# EAGLE design StackOverflow (EAGLE 5.06)
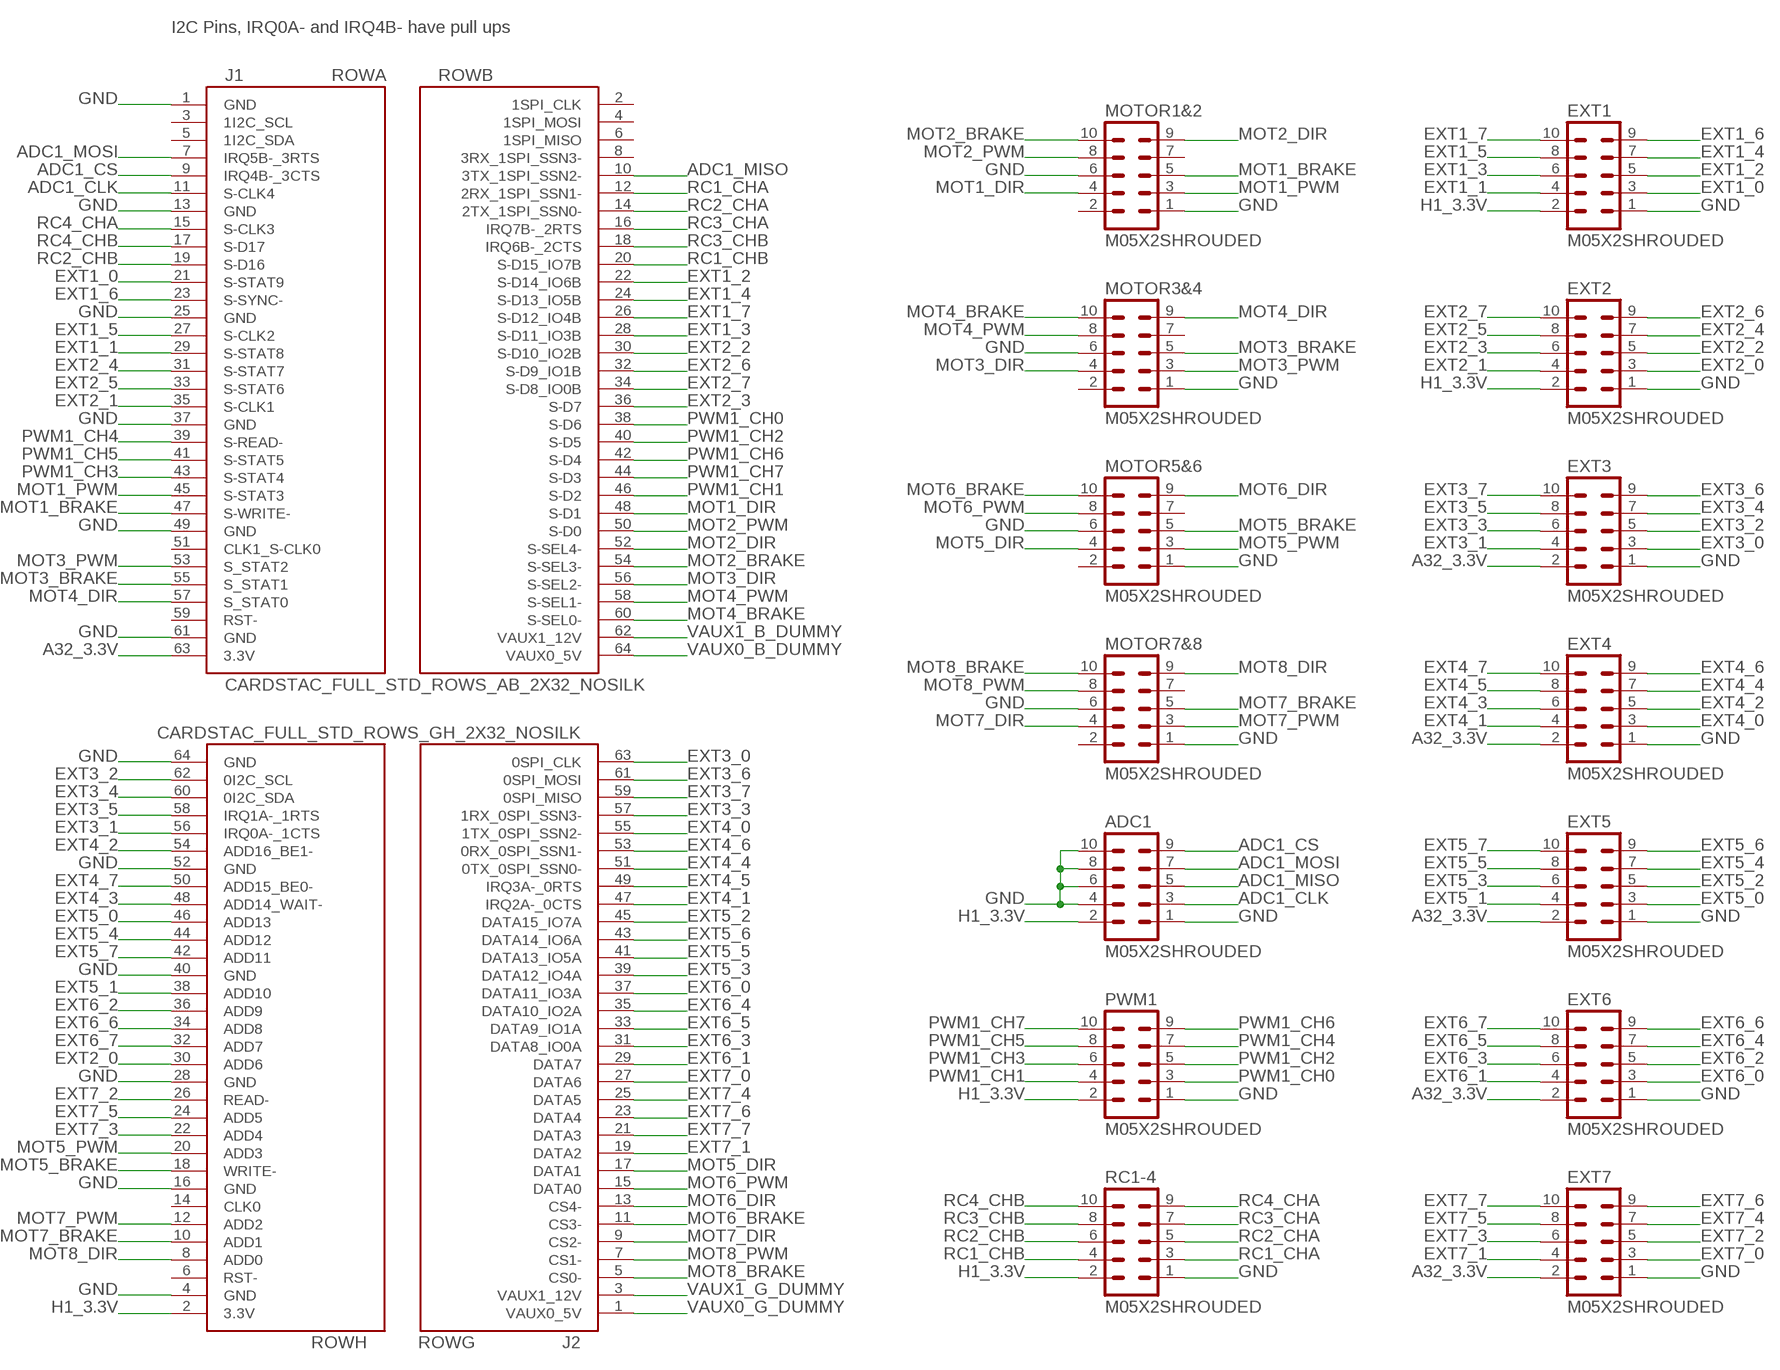
[diagram p0: schematic, sheet 1]

## Parts
ADC1  M05X2SHROUDED  [2X05/SHROUDED]
EXT1  M05X2SHROUDED  [2X05/SHROUDED]
EXT2  M05X2SHROUDED  [2X05/SHROUDED]
EXT3  M05X2SHROUDED  [2X05/SHROUDED]
EXT4  M05X2SHROUDED  [2X05/SHROUDED]
EXT5  M05X2SHROUDED  [2X05/SHROUDED]
EXT6  M05X2SHROUDED  [2X05/SHROUDED]
EXT7  M05X2SHROUDED  [2X05/SHROUDED]
J1  CARDSTAC_FULL_STD_ROWS_AB_2X32_NOSILK  [2X32/NOSILK]
J2  CARDSTAC_FULL_STD_ROWS_GH_2X32_NOSILK  [2X32/NOSILK]
MOTOR1&2  M05X2SHROUDED  [2X05/SHROUDED]
MOTOR3&4  M05X2SHROUDED  [2X05/SHROUDED]
MOTOR5&6  M05X2SHROUDED  [2X05/SHROUDED]
MOTOR7&8  M05X2SHROUDED  [2X05/SHROUDED]
PWM1  M05X2SHROUDED  [2X05/SHROUDED]
RC1-4  M05X2SHROUDED  [2X05/SHROUDED]

## Nets
A32_3.3V: EXT3.2 EXT4.2 EXT5.2 EXT6.2 EXT7.2 J1.63(3.3V)
ADC1_CLK: ADC1.3 J1.11(S-CLK4)
ADC1_CS: ADC1.9 J1.9(IRQ4B-_3CTS)
ADC1_MISO: ADC1.5 J1.10(3TX_1SPI_SSN2-)
ADC1_MOSI: ADC1.7 J1.7(IRQ5B-_3RTS)
EXT1_0: EXT1.3 J1.21(S-STAT9)
EXT1_1: EXT1.4 J1.29(S-STAT8)
EXT1_2: EXT1.5 J1.22(S-D14_IO6B)
EXT1_3: EXT1.6 J1.28(S-D11_IO3B)
EXT1_4: EXT1.7 J1.24(S-D13_IO5B)
EXT1_5: EXT1.8 J1.27(S-CLK2)
EXT1_6: EXT1.9 J1.23(S-SYNC-)
EXT1_7: EXT1.10 J1.26(S-D12_IO4B)
EXT2_0: EXT2.3 J2.30(ADD6)
EXT2_1: EXT2.4 J1.35(S-CLK1)
EXT2_2: EXT2.5 J1.30(S-D10_IO2B)
EXT2_3: EXT2.6 J1.36(S-D7)
EXT2_4: EXT2.7 J1.31(S-STAT7)
EXT2_5: EXT2.8 J1.33(S-STAT6)
EXT2_6: EXT2.9 J1.32(S-D9_IO1B)
EXT2_7: EXT2.10 J1.34(S-D8_IO0B)
EXT3_0: EXT3.3 J2.63(0SPI_CLK)
EXT3_1: EXT3.4 J2.56(IRQ0A-_1CTS)
EXT3_2: EXT3.5 J2.62(0I2C_SCL)
EXT3_3: EXT3.6 J2.57(1RX_0SPI_SSN3-)
EXT3_4: EXT3.7 J2.60(0I2C_SDA)
EXT3_5: EXT3.8 J2.58(IRQ1A-_1RTS)
EXT3_6: EXT3.9 J2.61(0SPI_MOSI)
EXT3_7: EXT3.10 J2.59(0SPI_MISO)
EXT4_0: EXT4.3 J2.55(1TX_0SPI_SSN2-)
EXT4_1: EXT4.4 J2.47(IRQ2A-_0CTS)
EXT4_2: EXT4.5 J2.54(ADD16_BE1-)
EXT4_3: EXT4.6 J2.48(ADD14_WAIT-)
EXT4_4: EXT4.7 J2.51(0TX_0SPI_SSN0-)
EXT4_5: EXT4.8 J2.49(IRQ3A-_0RTS)
EXT4_6: EXT4.9 J2.53(0RX_0SPI_SSN1-)
EXT4_7: EXT4.10 J2.50(ADD15_BE0-)
EXT5_0: EXT5.3 J2.46(ADD13)
EXT5_1: EXT5.4 J2.38(ADD10)
EXT5_2: EXT5.5 J2.45(DATA15_IO7A)
EXT5_3: EXT5.6 J2.39(DATA12_IO4A)
EXT5_4: EXT5.7 J2.44(ADD12)
EXT5_5: EXT5.8 J2.41(DATA13_IO5A)
EXT5_6: EXT5.9 J2.43(DATA14_IO6A)
EXT5_7: EXT5.10 J2.42(ADD11)
EXT6_0: EXT6.3 J2.37(DATA11_IO3A)
EXT6_1: EXT6.4 J2.29(DATA7)
EXT6_2: EXT6.5 J2.36(ADD9)
EXT6_3: EXT6.6 J2.31(DATA8_IO0A)
EXT6_4: EXT6.7 J2.35(DATA10_IO2A)
EXT6_5: EXT6.8 J2.33(DATA9_IO1A)
EXT6_6: EXT6.9 J2.34(ADD8)
EXT6_7: EXT6.10 J2.32(ADD7)
EXT7_0: EXT7.3 J2.27(DATA6)
EXT7_1: EXT7.4 J2.19(DATA2)
EXT7_2: EXT7.5 J2.26(READ-)
EXT7_3: EXT7.6 J2.22(ADD4)
EXT7_4: EXT7.7 J2.25(DATA5)
EXT7_5: EXT7.8 J2.24(ADD5)
EXT7_6: EXT7.9 J2.23(DATA4)
EXT7_7: EXT7.10 J2.21(DATA3)
GND: ADC1.1 ADC1.4 ADC1.6 ADC1.8 ADC1.10 EXT1.1 EXT2.1 EXT3.1 EXT4.1 EXT5.1 EXT6.1 EXT7.1 J1.1(GND) J1.13(GND) J1.25(GND) J1.37(GND) J1.49(GND) J1.61(GND) J2.4(GND) J2.16(GND) J2.28(GND) J2.40(GND) J2.52(GND) J2.64(GND) MOTOR1&2.1 MOTOR1&2.6 MOTOR3&4.1 MOTOR3&4.6 MOTOR5&6.1 MOTOR5&6.6 MOTOR7&8.1 MOTOR7&8.6 PWM1.1 RC1-4.1
H1_3.3V: ADC1.2 EXT1.2 EXT2.2 J2.2(3.3V) PWM1.2 RC1-4.2
MOT1_BRAKE: J1.47(S-WRITE-) MOTOR1&2.5
MOT1_DIR: J1.48(S-D1) MOTOR1&2.4
MOT1_PWM: J1.45(S-STAT3) MOTOR1&2.3
MOT2_BRAKE: J1.54(S-SEL3-) MOTOR1&2.10
MOT2_DIR: J1.52(S-SEL4-) MOTOR1&2.9
MOT2_PWM: J1.50(S-D0) MOTOR1&2.8
MOT3_BRAKE: J1.55(S_STAT1) MOTOR3&4.5
MOT3_DIR: J1.56(S-SEL2-) MOTOR3&4.4
MOT3_PWM: J1.53(S_STAT2) MOTOR3&4.3
MOT4_BRAKE: J1.60(S-SEL0-) MOTOR3&4.10
MOT4_DIR: J1.57(S_STAT0) MOTOR3&4.9
MOT4_PWM: J1.58(S-SEL1-) MOTOR3&4.8
MOT5_BRAKE: J2.18(WRITE-) MOTOR5&6.5
MOT5_DIR: J2.17(DATA1) MOTOR5&6.4
MOT5_PWM: J2.20(ADD3) MOTOR5&6.3
MOT6_BRAKE: J2.11(CS3-) MOTOR5&6.10
MOT6_DIR: J2.13(CS4-) MOTOR5&6.9
MOT6_PWM: J2.15(DATA0) MOTOR5&6.8
MOT7_BRAKE: J2.10(ADD1) MOTOR7&8.5
MOT7_DIR: J2.9(CS2-) MOTOR7&8.4
MOT7_PWM: J2.12(ADD2) MOTOR7&8.3
MOT8_BRAKE: J2.5(CS0-) MOTOR7&8.10
MOT8_DIR: J2.8(ADD0) MOTOR7&8.9
MOT8_PWM: J2.7(CS1-) MOTOR7&8.8
PWM1_CH0: J1.38(S-D6) PWM1.3
PWM1_CH1: J1.46(S-D2) PWM1.4
PWM1_CH2: J1.40(S-D5) PWM1.5
PWM1_CH3: J1.43(S-STAT4) PWM1.6
PWM1_CH4: J1.39(S-READ-) PWM1.7
PWM1_CH5: J1.41(S-STAT5) PWM1.8
PWM1_CH6: J1.42(S-D4) PWM1.9
PWM1_CH7: J1.44(S-D3) PWM1.10
RC1_CHA: J1.12(2RX_1SPI_SSN1-) RC1-4.3
RC1_CHB: J1.20(S-D15_IO7B) RC1-4.4
RC2_CHA: J1.14(2TX_1SPI_SSN0-) RC1-4.5
RC2_CHB: J1.19(S-D16) RC1-4.6
RC3_CHA: J1.16(IRQ7B-_2RTS) RC1-4.7
RC3_CHB: J1.18(IRQ6B-_2CTS) RC1-4.8
RC4_CHA: J1.15(S-CLK3) RC1-4.9
RC4_CHB: J1.17(S-D17) RC1-4.10
VAUX0_B_DUMMY: J1.64(VAUX0_5V)
VAUX0_G_DUMMY: J2.1(VAUX0_5V)
VAUX1_B_DUMMY: J1.62(VAUX1_12V)
VAUX1_G_DUMMY: J2.3(VAUX1_12V)
Unconnected: J1.2(1SPI_CLK) J1.3(1I2C_SCL) J1.4(1SPI_MOSI) J1.5(1I2C_SDA) J1.6(1SPI_MISO) J1.8(3RX_1SPI_SSN3-) J1.51(CLK1_S-CLK0) J1.59(RST-) J2.6(RST-) J2.14(CLK0) MOTOR1&2.2 MOTOR1&2.7 MOTOR3&4.2 MOTOR3&4.7 MOTOR5&6.2 MOTOR5&6.7 MOTOR7&8.2 MOTOR7&8.7

## Notes on the sheet
- I2C Pins, IRQ0A- and IRQ4B- have pull ups

## Library data of the parts
ADC1 EXT1-EXT7 MOTOR1&2 MOTOR3&4 MOTOR5&6 MOTOR7&8 PWM1 RC1-4 = Robot:M05X2: 10-PIN DUAL ROW HEADER Standard 10-pin dual row 0.1" header.
J1 = Robot:CARDSTAC_FULL_STD_ROWS_AB: Rows A and B of the Cardstac specification.
J2 = Robot:CARDSTAC_FULL_STD_ROWS_GH: Rows G and H of the Cardstac specification.

## Board
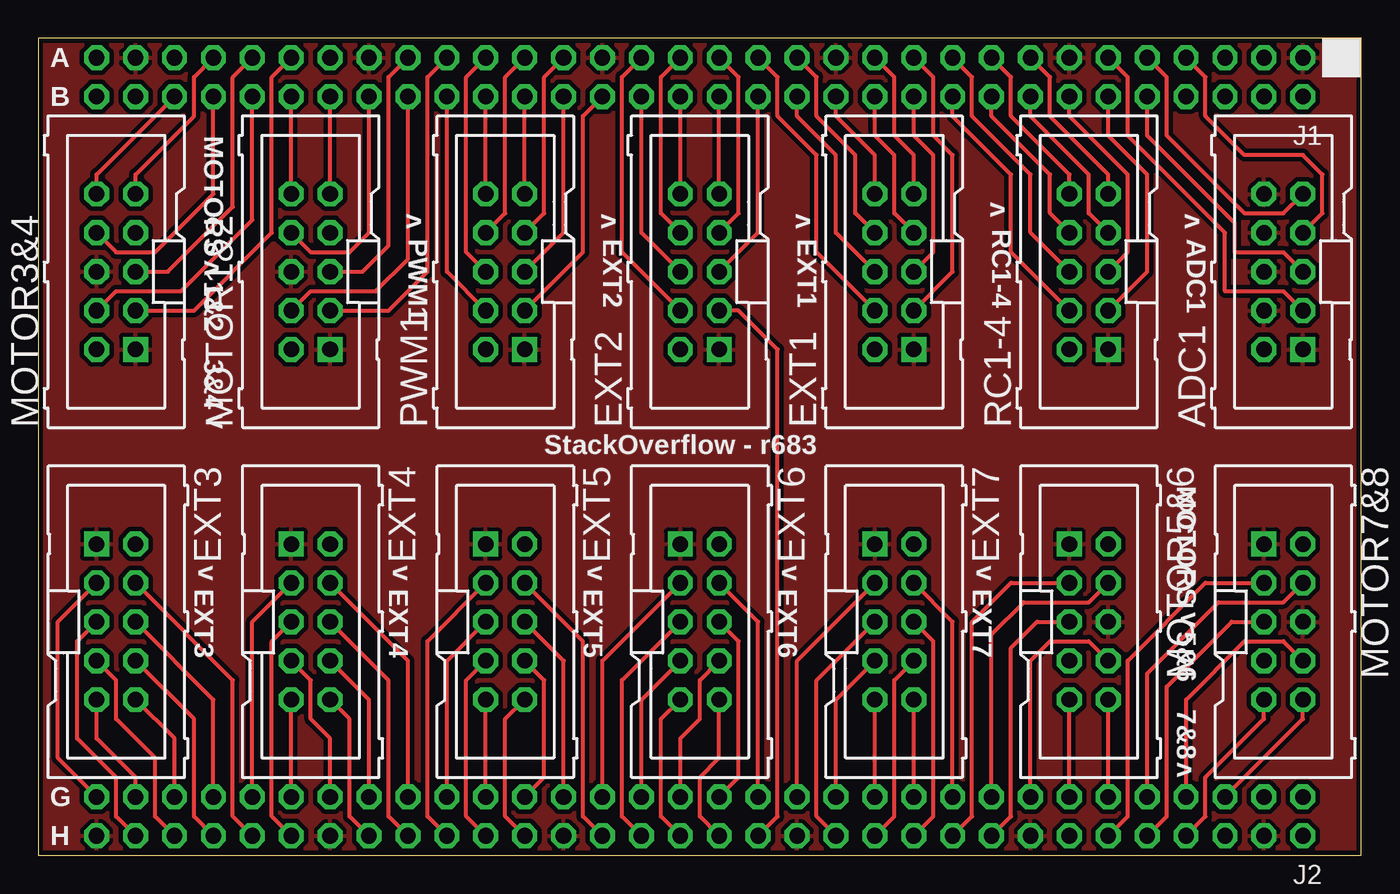
[diagram p1: board, top side]
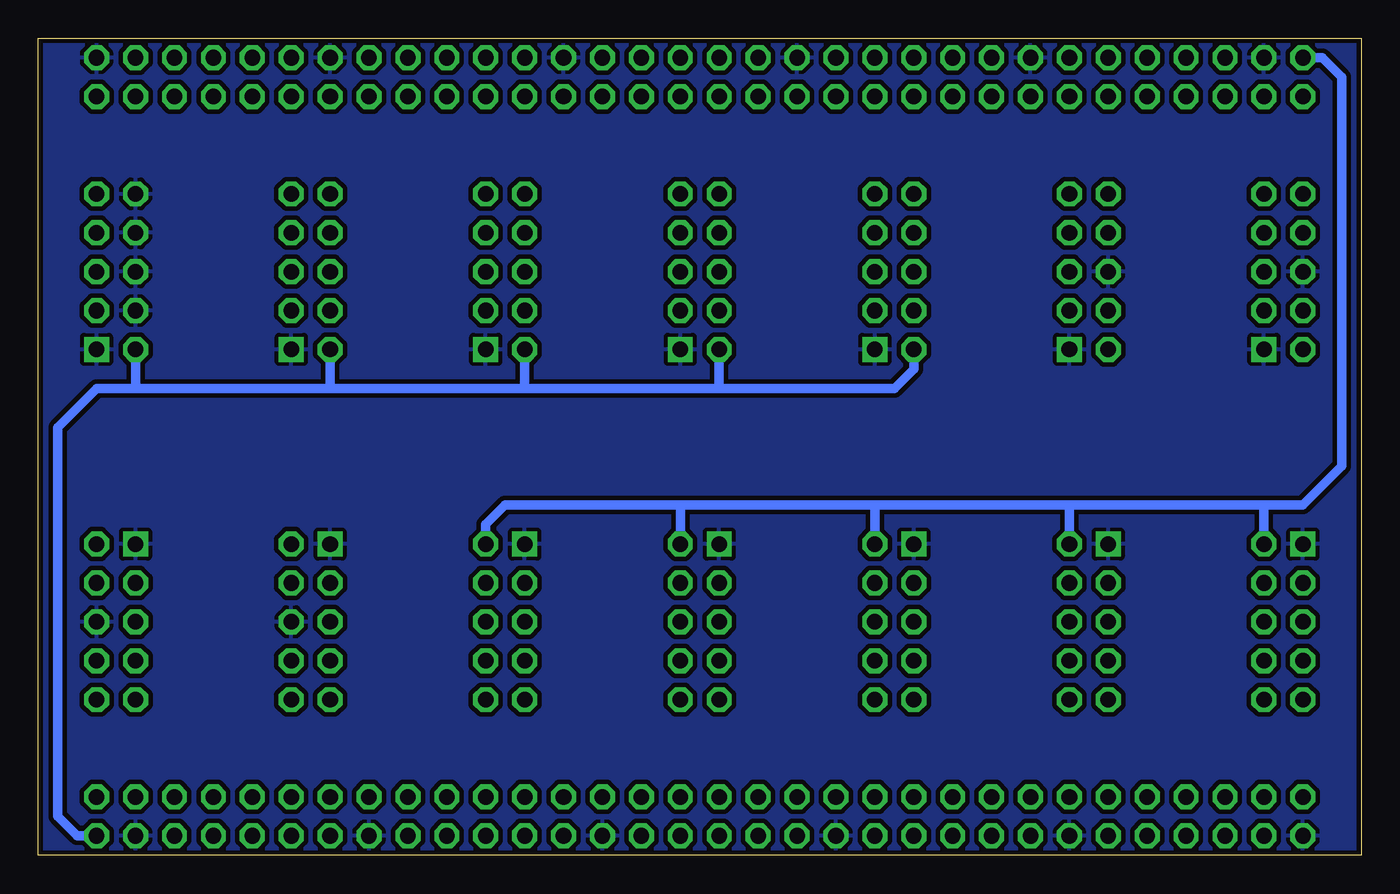
[diagram p2: board, bottom side, seen from below]

Size 86.36 x 53.34 mm. Coordinates in mm from the lower left corner, seen from the top.
Outline: 0,0 86.36,0 86.36,53.34 0,53.34 0,0
Copper layers (1*16): Top 0.035mm / dielectric 1.5mm / Bottom 0.035mm
Design rules "SparkFun": minimum track width 8mil, minimum drill 20mil, track to track 8mil, track to pad 8mil, pad to pad 8mil, via to via 8mil, smd to smd 8mil, copper to edge 10mil, drill to drill 8mil, minimum pad ring 12mil, minimum via ring 10mil, stop-mask expansion 4mil, vias tented up to drill 25mil, thermal gap 10mil

### Footprints (pad centres in the part's own frame; a part is rotated, then mirrored left to right if it is on the bottom)
2X05/SHROUDED = drill 1.016 square: 1 -5.08,-1.27 | drill 1.016 octagon: 2 -5.08,1.27; 3 -2.54,-1.27; 4 -2.54,1.27; 5 0,-1.27; 6 0,1.27; 7 2.54,-1.27; 8 2.54,1.27; 9 5.08,-1.27; 10 5.08,1.27
2X32/NOSILK = drill 1.016 octagon: 1 -39.37,-1.27; 2 -39.37,1.27; 3 -36.83,-1.27; 4 -36.83,1.27; 5 -34.29,-1.27; 6 -34.29,1.27; 7 -31.75,-1.27; 8 -31.75,1.27; 9 -29.21,-1.27; 10 -29.21,1.27; 11 -26.67,-1.27; 12 -26.67,1.27; 13 -24.13,-1.27; 14 -24.13,1.27; 15 -21.59,-1.27; 16 -21.59,1.27; 17 -19.05,-1.27; 18 -19.05,1.27; 19 -16.51,-1.27; 20 -16.51,1.27; 21 -13.97,-1.27; 22 -13.97,1.27; 23 -11.43,-1.27; 24 -11.43,1.27; 25 -8.89,-1.27; 26 -8.89,1.27; 27 -6.35,-1.27; 28 -6.35,1.27; 29 -3.81,-1.27; 30 -3.81,1.27; 31 -1.27,-1.27; 32 -1.27,1.27; 33 1.27,-1.27; 34 1.27,1.27; 35 3.81,-1.27; 36 3.81,1.27; 37 6.35,-1.27; 38 6.35,1.27; 39 8.89,-1.27; 40 8.89,1.27; 41 11.43,-1.27; 42 11.43,1.27; 43 13.97,-1.27; 44 13.97,1.27; 45 16.51,-1.27; 46 16.51,1.27; 47 19.05,-1.27; 48 19.05,1.27; 49 21.59,-1.27; 50 21.59,1.27; 51 24.13,-1.27; 52 24.13,1.27; 53 26.67,-1.27; 54 26.67,1.27; 55 29.21,-1.27; 56 29.21,1.27; 57 31.75,-1.27; 58 31.75,1.27; 59 34.29,-1.27; 60 34.29,1.27; 61 36.83,-1.27; 62 36.83,1.27; 63 39.37,-1.27; 64 39.37,1.27

### Placement (x,y rotation side)
ADC1  81.28,38.1 90 top
EXT1  55.88,38.1 90 top
EXT2  43.18,38.1 90 top
EXT3  5.08,15.24 270 top
EXT4  17.78,15.24 270 top
EXT5  30.48,15.24 270 top
EXT6  43.18,15.24 270 top
EXT7  55.88,15.24 270 top
J1  43.18,50.8 180 top
J2  43.18,2.54 180 top
MOTOR1&2  17.78,38.1 90 top
MOTOR3&4  5.08,38.1 90 top
MOTOR5&6  68.58,15.24 270 top
MOTOR7&8  81.28,15.24 270 top
PWM1  30.48,38.1 90 top
RC1-4  68.58,38.1 90 top

### Tracks (layer width: path | path; a pad name or v marks a point on that pad's centre or on a via)
A32_3.3V
  Bottom 0.61: 6.35,22.86 3.81,22.86 1.27,25.4 1.27,50.8 2.54,52.07 J1.63 | 6.35,22.86 19.05,22.86 | 19.05,22.86 31.75,22.86 | 31.75,22.86 44.45,22.86 | 44.45,22.86 55.88,22.86 57.15,21.59 EXT7.2 | EXT3.2 6.35,22.86 | 31.75,22.86 EXT5.2 | 19.05,22.86 EXT4.2 | 44.45,22.86 EXT6.2
ADC1_CLK
  Top 0.254: J1.11 71.12,50.8 71.12,46.99 77.47,40.64 77.47,36.83 81.28,36.83 ADC1.3
ADC1_CS
  Top 0.254: J1.9 73.66,50.8 73.66,46.99 78.74,41.91 81.28,41.91 ADC1.9
ADC1_MISO
  Top 0.254: J1.10 72.39,46.99 78.11,41.27 78.11,39.37 81.28,39.37 ADC1.5
ADC1_MOSI
  Top 0.254: J1.7 76.2,50.8 76.2,48.26 78.74,45.72 82.55,45.72 83.82,44.45 83.82,41.91 ADC1.7
EXT1_0
  Top 0.254: J1.21 58.42,50.8 58.42,46.99 59.69,45.72 59.69,38.1 EXT1.3
EXT1_1
  Top 0.254: J1.29 48.26,50.8 48.26,48.26 50.8,45.72 50.8,39.37 EXT1.4
EXT1_2
  Top 0.254: J1.22 57.15,46.99 58.42,45.72 58.42,39.37 EXT1.5
EXT1_3
  Top 0.254: EXT1.6 52.07,40.64 52.07,45.72 49.53,48.26 J1.28
EXT1_4
  Top 0.254: J1.24 54.61,46.99 55.88,45.72 55.88,41.91 EXT1.7
EXT1_5
  Top 0.254: J1.27 50.8,50.8 50.8,48.26 53.34,45.72 53.34,41.91 EXT1.8
EXT1_6
  Top 0.254: J1.23 55.88,50.8 55.88,46.99 57.15,45.72 EXT1.9
EXT1_7
  Top 0.254: J1.26 52.07,48.26 54.61,45.72 EXT1.10
EXT2_0
  Top 0.254: J2.30 48.26,2.54 48.26,33.02 45.72,35.56 EXT2.3
EXT2_1
  Top 0.254: EXT2.4 38.1,39.37 38.1,50.8 J1.35
EXT2_2
  Top 0.254: EXT2.5 46.99,40.64 J1.30
EXT2_3
  Top 0.254: J1.36 39.37,40.64 EXT2.6
EXT2_4
  Top 0.254: EXT2.7 45.72,41.91 45.72,50.8 J1.31
EXT2_5
  Top 0.254: EXT2.8 40.64,41.91 40.64,50.8 J1.33
EXT2_6
  Top 0.254: EXT2.9 J1.32
EXT2_7
  Top 0.254: EXT2.10 J1.34
EXT3_0
  Top 0.254: EXT3.3 1.27,15.24 1.27,6.35 J2.63
EXT3_1
  Top 0.254: EXT3.4 12.7,11.43 12.7,2.54 J2.56
EXT3_2
  Top 0.254: EXT3.5 2.54,13.97 2.54,7.62 5.08,5.08 5.08,2.54 J2.62
EXT3_3
  Top 0.254: J2.57 11.43,10.16 EXT3.6
EXT3_4
  Top 0.254: EXT3.7 5.08,11.43 5.08,8.89 7.62,6.35 7.62,2.54 J2.60
EXT3_5
  Top 0.254: EXT3.8 10.16,8.89 10.16,2.54 J2.58
EXT3_6
  Top 0.254: EXT3.9 3.81,7.62 6.35,5.08 J2.61
EXT3_7
  Top 0.254: EXT3.10 8.89,7.62 J2.59
EXT4_0
  Top 0.254: EXT4.3 13.97,15.24 J2.55
EXT4_1
  Top 0.254: EXT4.4 24.13,12.7 J2.47
EXT4_2
  Top 0.254: EXT4.5 15.24,13.97 15.24,2.54 J2.54
EXT4_3
  Top 0.254: EXT4.6 22.86,11.43 22.86,2.54 J2.48
EXT4_4
  Top 0.254: J2.51 19.05,7.62 17.78,8.89 17.78,11.43 EXT4.7
EXT4_5
  Top 0.254: EXT4.8 21.59,10.16 J2.49
EXT4_6
  Top 0.254: J2.53 EXT4.9
EXT4_7
  Top 0.254: EXT4.10 20.32,8.89 20.32,2.54 J2.50
EXT5_0
  Top 0.254: EXT5.3 25.4,13.97 25.4,2.54 J2.46
EXT5_1
  Top 0.254: EXT5.4 35.56,13.97 35.56,2.54 J2.38
EXT5_2
  Top 0.254: EXT5.5 26.67,12.7 J2.45
EXT5_3
  Top 0.254: EXT5.6 34.29,12.7 J2.39
EXT5_4
  Top 0.254: EXT5.7 27.94,11.43 27.94,2.54 J2.44
EXT5_5
  Top 0.254: EXT5.8 33.02,11.43 33.02,5.08 J2.41
EXT5_6
  Top 0.254: J2.43 EXT5.9
EXT5_7
  Top 0.254: EXT5.10 30.48,8.89 30.48,2.54 J2.42
EXT6_0
  Top 0.254: EXT6.3 36.83,12.7 J2.37
EXT6_1
  Top 0.254: EXT6.4 46.99,15.24 J2.29
EXT6_2
  Top 0.254: EXT6.5 38.1,11.43 38.1,2.54 J2.36
EXT6_3
  Top 0.254: EXT6.6 45.72,13.97 45.72,5.08 J2.31
EXT6_4
  Top 0.254: EXT6.7 39.37,10.16 J2.35
EXT6_5
  Top 0.254: J2.33 41.91,7.62 43.18,8.89 43.18,11.43 EXT6.8
EXT6_6
  Top 0.254: EXT6.9 40.64,8.89 40.64,2.54 J2.34
EXT6_7
  Top 0.254: J2.32 43.18,2.54 43.18,5.08 44.45,6.35 EXT6.10
EXT7_0
  Top 0.254: EXT7.3 49.53,12.7 J2.27
EXT7_1
  Top 0.254: EXT7.4 59.69,15.24 J2.19
EXT7_2
  Top 0.254: EXT7.5 50.8,11.43 50.8,2.54 J2.26
EXT7_3
  Top 0.254: EXT7.6 58.42,13.97 58.42,2.54 J2.22
EXT7_4
  Top 0.254: EXT7.7 52.07,10.16 J2.25
EXT7_5
  Top 0.254: J2.24 55.88,2.54 55.88,11.43 EXT7.8
EXT7_6
  Top 0.254: J2.23 EXT7.9
EXT7_7
  Top 0.254: J2.21 EXT7.10
GND
  pour Top (isolate 0.305): 0,0 0,53.34 86.36,53.34 86.36,0
  pour Bottom (isolate 0.305): 0,0 0,53.34 86.36,53.34 86.36,0
H1_3.3V
  Bottom 0.61: J2.2 83.82,1.27 85.09,2.54 85.09,27.94 82.55,30.48 80.01,30.48 | 54.61,30.48 67.31,30.48 | 67.31,30.48 80.01,30.48 | 54.61,30.48 EXT1.2 | 41.91,30.48 30.48,30.48 29.21,31.75 PWM1.2 | 41.91,30.48 54.61,30.48 | 67.31,30.48 RC1-4.2 | 80.01,30.48 ADC1.2 | 41.91,30.48 EXT2.2
MOT1_BRAKE
  Top 0.254: J1.47 22.86,50.8 22.86,39.8 21.16,38.1 MOTOR1&2.5
MOT1_DIR
  Top 0.254: MOTOR1&2.4 17.78,36.83 22.02,36.83 24.13,38.94 J1.48
MOT1_PWM
  Top 0.254: J1.45 25.4,50.8 25.4,38.1 22.86,35.56 MOTOR1&2.3
MOT2_BRAKE
  Top 0.254: MOTOR1&2.10 J1.54
MOT2_DIR
  Top 0.254: MOTOR1&2.9 J1.52
MOT2_PWM
  Top 0.254: J1.50 21.59,40.64 20.32,39.37 17.78,39.37 MOTOR1&2.8
MOT3_BRAKE
  Top 0.254: J1.55 12.7,50.8 12.7,42.34 8.46,38.1 MOTOR3&4.5
MOT3_DIR
  Top 0.254: J1.56 13.97,41.48 9.32,36.83 5.08,36.83 MOTOR3&4.4
MOT3_PWM
  Top 0.254: J1.53 15.24,50.8 15.24,40.64 10.16,35.56 MOTOR3&4.3
MOT4_BRAKE
  Top 0.254: MOTOR3&4.10 3.81,44.45 J1.60
MOT4_DIR
  Top 0.254: J1.57 10.16,50.8 10.16,48.26 6.35,44.45 MOTOR3&4.9
MOT4_PWM
  Top 0.254: MOTOR3&4.8 5.08,39.37 7.62,39.37 11.43,43.18 J1.58
MOT5_BRAKE
  Top 0.254: J2.18 63.5,2.54 63.5,13.54 65.2,15.24 MOTOR5&6.5
MOT5_DIR
  Top 0.254: MOTOR5&6.4 68.58,16.51 64.34,16.51 62.23,14.4 J2.17
MOT5_PWM
  Top 0.254: J2.20 60.96,2.54 60.96,15.24 63.5,17.78 MOTOR5&6.3
MOT6_BRAKE
  Top 0.254: J2.11 MOTOR5&6.10
MOT6_DIR
  Top 0.254: J2.13 MOTOR5&6.9
MOT6_PWM
  Top 0.254: MOTOR5&6.8 68.58,13.97 66.04,13.97 64.77,12.7 J2.15
MOT7_BRAKE
  Top 0.254: J2.10 73.66,2.54 73.66,11 77.9,15.24 MOTOR7&8.5
MOT7_DIR
  Top 0.254: MOTOR7&8.4 81.28,16.51 77.04,16.51 72.39,11.86 J2.9
MOT7_PWM
  Top 0.254: J2.12 71.12,2.54 71.12,12.7 76.2,17.78 MOTOR7&8.3
MOT8_BRAKE
  Top 0.254: J2.5 82.55,8.89 MOTOR7&8.10
MOT8_DIR
  Top 0.254: J2.8 76.2,2.54 76.2,5.08 80.01,8.89 MOTOR7&8.9
MOT8_PWM
  Top 0.254: MOTOR7&8.8 81.28,13.97 78.74,13.97 74.93,10.16 J2.7
PWM1_CH0
  Top 0.254: J1.38 35.56,48.26 35.56,39.37 PWM1.3
PWM1_CH1
  Top 0.254: J1.46 26.67,38.1 PWM1.4
PWM1_CH2
  Top 0.254: J1.40 34.29,40.64 PWM1.5
PWM1_CH3
  Top 0.254: PWM1.6 27.94,39.37 27.94,50.8 J1.43
PWM1_CH4
  Top 0.254: J1.39 33.02,50.8 33.02,41.91 PWM1.7
PWM1_CH5
  Top 0.254: PWM1.8 30.48,41.91 30.48,50.8 J1.41
PWM1_CH6
  Top 0.254: PWM1.9 J1.42
PWM1_CH7
  Top 0.254: PWM1.10 J1.44
RC1_CHA
  Top 0.254: RC1-4.3 72.39,38.1 72.39,44.45 69.85,46.99 J1.12
RC1_CHB
  Top 0.254: RC1-4.4 63.5,39.37 63.5,44.45 59.69,48.26 J1.20
RC2_CHA
  Top 0.254: J1.14 67.31,48.26 71.12,44.45 71.12,39.37 RC1-4.5
RC2_CHB
  Top 0.254: RC1-4.6 64.77,40.64 64.77,44.45 60.96,48.26 60.96,50.8 J1.19
RC3_CHA
  Top 0.254: J1.16 64.77,48.26 68.58,44.45 68.58,41.91 RC1-4.7
RC3_CHB
  Top 0.254: RC1-4.8 66.04,41.91 66.04,44.45 62.23,48.26 J1.18
RC4_CHA
  Top 0.254: J1.15 66.04,50.8 66.04,48.26 69.85,44.45 RC1-4.9
RC4_CHB
  Top 0.254: J1.17 63.5,50.8 63.5,48.26 67.31,44.45 RC1-4.10

### Text on the board
tPlace: A | B | MOTORS | v | v | v | v | RC1-4 | v | PWM1 | EXT2 | EXT1 | ADC1 | v | 1&2 | 3&4 | v | StackOverflow - r683 | MOTORS | v | v | v | v | v | EXT3 | EXT4 | EXT5 | EXT6 | EXT7 | v | 5&6 | 7&8 | v | G | H